# Altium schematic sheet BalEv_AIN_v1_0.SchDoc
size A3; CompanyName: HESSO; Address1: Route du Rawyl 47; Address2: 1950 Sion; Address3: Switzerland; DocumentNumber: 3; SheetNumber: 6; SheetTotal: 7; PageSetup: Record=PageOptions|CenterHorizontal=True|CenterVertical=True|PrintScale=1.00|XCorrection=1.00|YCorrection=1.00|PrintKind=1|BorderSize=5000000|LeftOffset=0|BottomOffset=0|Orientation=2|PaperLength=1000|PaperWidth=1000|Scale=100|PaperSource=15|PrintQuality=1200|MediaType=1|DitherType=10|PrintScaleMode=1|PaperKind=A4|PaperIndex=9; ProjectName: Project Name
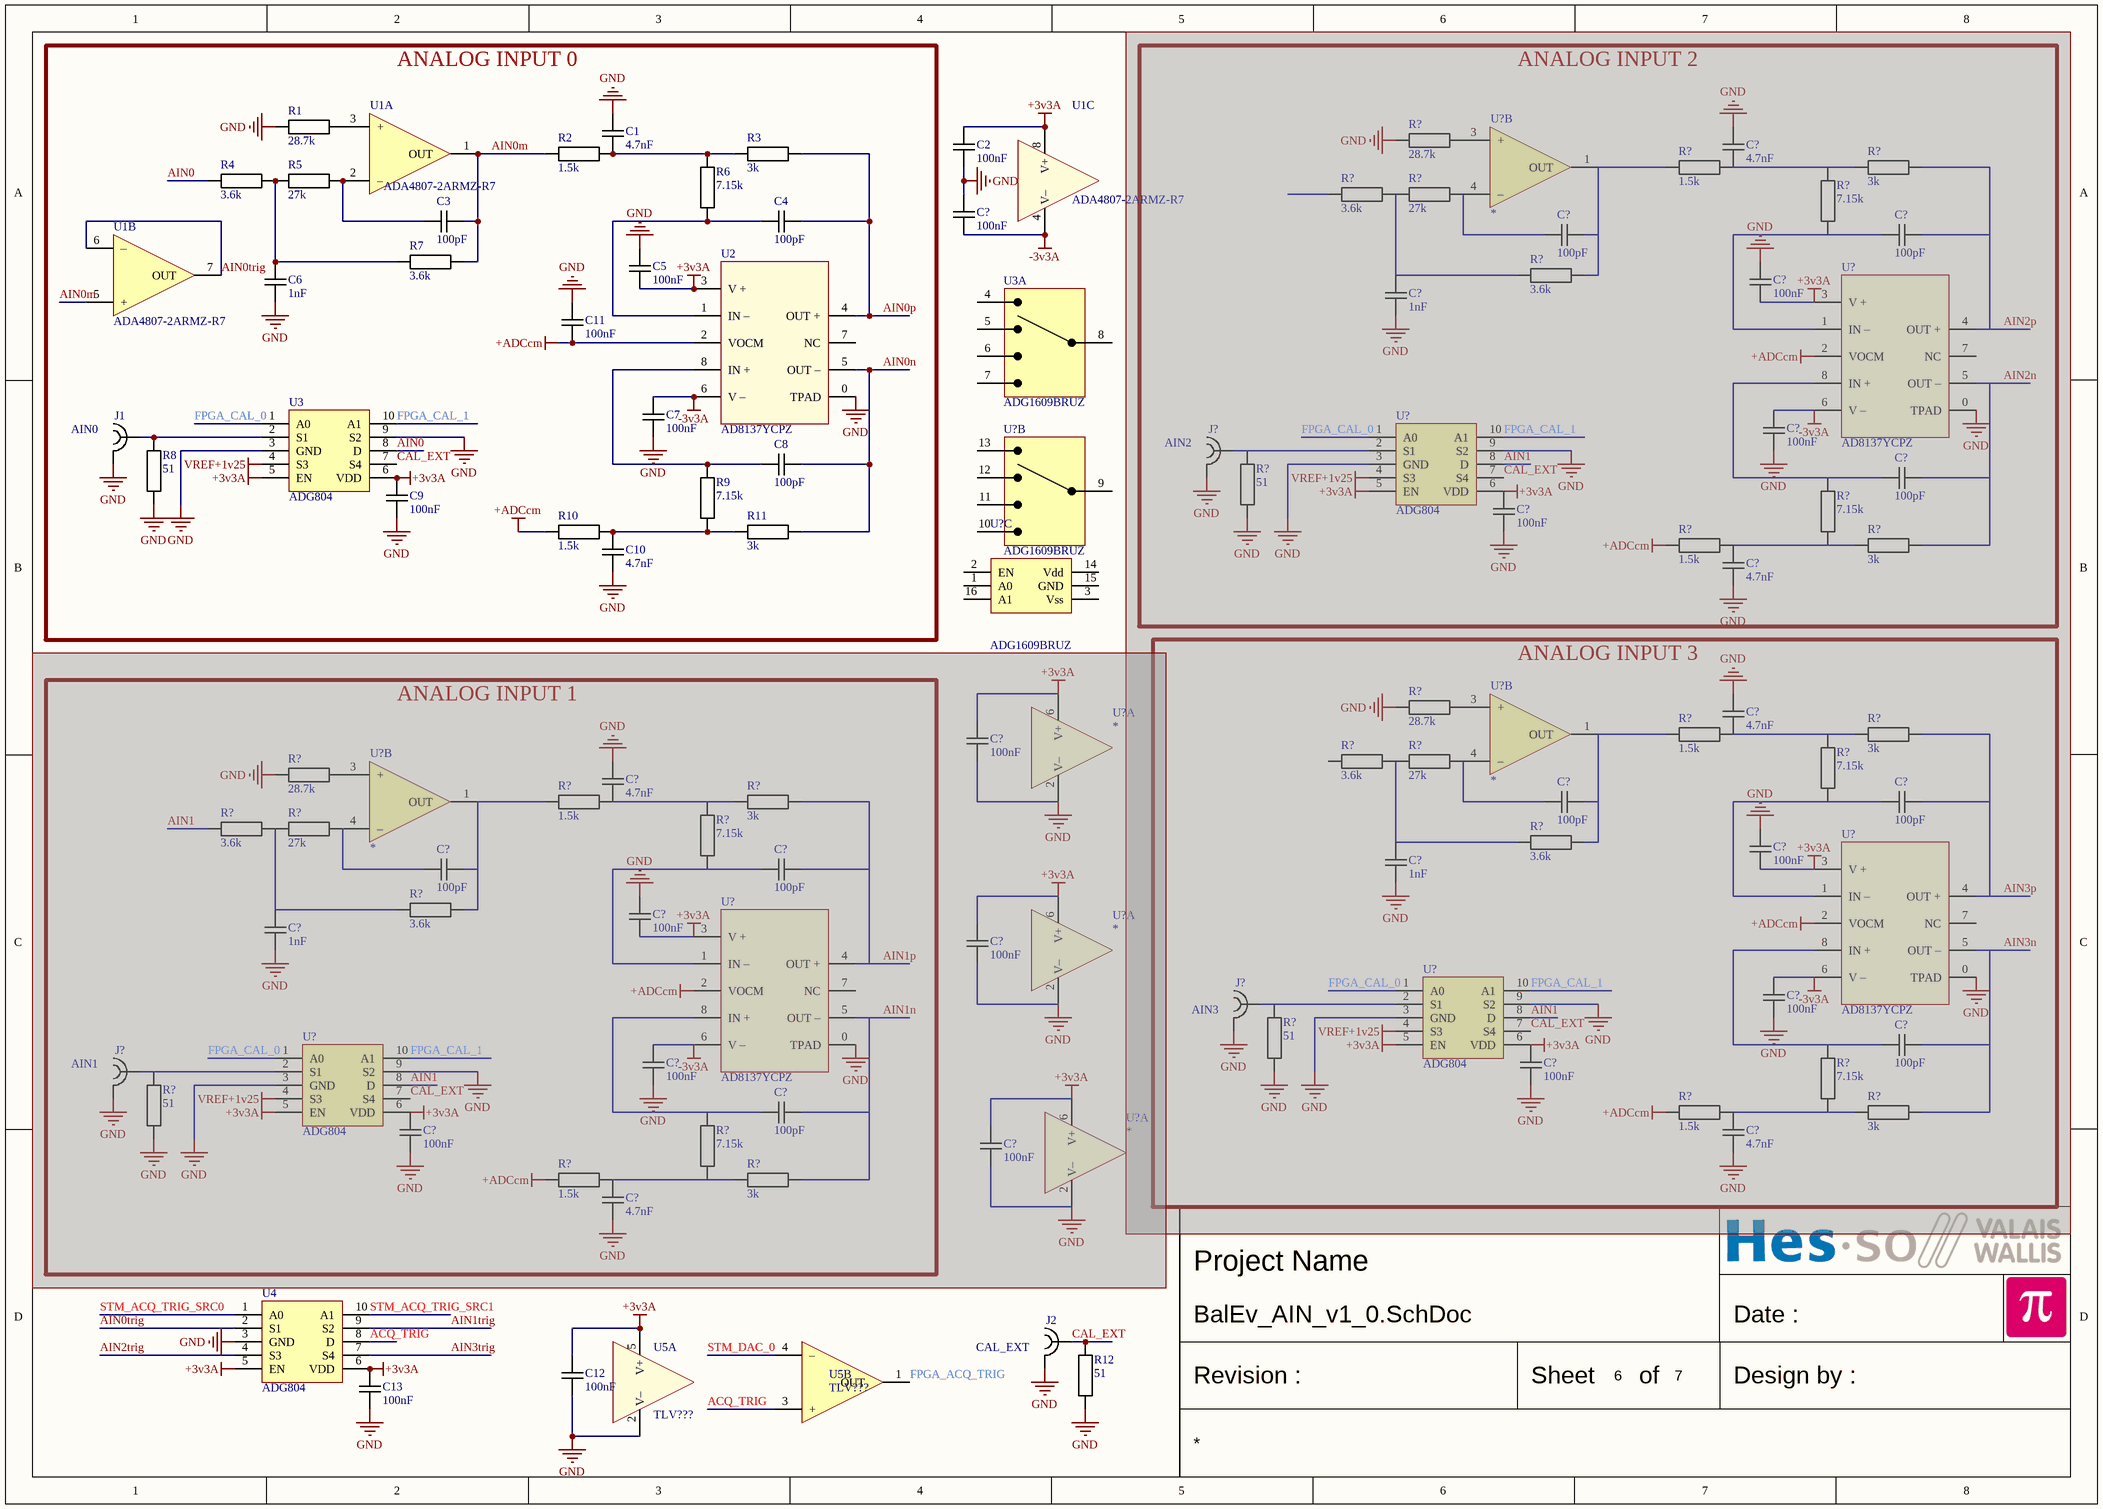
[diagram p0: BalEv_AIN_v1_0.SchDoc]

## Parts
(Parts that share a designator on the sheet are numbered #1, #2 ... from top to bottom, then left to right.)
C1  4.7nF  [CAPACITOR 1005 REFLOW]
C2  100nF  [CAPACITOR 1005 REFLOW]
C3  100pF  [CAPACITOR 1005 REFLOW]
C4  100pF  [CAPACITOR 1005 REFLOW]
C5  100nF  [CAPACITOR 1005 REFLOW]
C6  1nF  [CAPACITOR 1005 REFLOW]
C7  100nF  [CAPACITOR 1005 REFLOW]
C8  100pF  [CAPACITOR 1005 REFLOW]
C9  100nF  [CAPACITOR 1005 REFLOW]
C10  4.7nF  [CAPACITOR 1005 REFLOW]
C11  100nF  [CAPACITOR 1005 REFLOW]
C12  100nF  [CAPACITOR 1005 REFLOW]
C13  100nF  [CAPACITOR 1005 REFLOW]
C?#1  4.7nF  [CAPACITOR 1005 REFLOW]  (masked out: inside a compile mask, not in the netlist)
C?#2  100nF  [CAPACITOR 1005 REFLOW]
C?#3  100pF  [CAPACITOR 1005 REFLOW]  (masked out: inside a compile mask, not in the netlist)
C?#4  100pF  [CAPACITOR 1005 REFLOW]  (masked out: inside a compile mask, not in the netlist)
C?#5  100nF  [CAPACITOR 1005 REFLOW]  (masked out: inside a compile mask, not in the netlist)
C?#6  1nF  [CAPACITOR 1005 REFLOW]  (masked out: inside a compile mask, not in the netlist)
C?#7  100nF  [CAPACITOR 1005 REFLOW]  (masked out: inside a compile mask, not in the netlist)
C?#8  100pF  [CAPACITOR 1005 REFLOW]  (masked out: inside a compile mask, not in the netlist)
C?#9  100nF  [CAPACITOR 1005 REFLOW]  (masked out: inside a compile mask, not in the netlist)
C?#10  4.7nF  [CAPACITOR 1005 REFLOW]  (masked out: inside a compile mask, not in the netlist)
C?#11  4.7nF  [CAPACITOR 1005 REFLOW]  (masked out: inside a compile mask, not in the netlist)
C?#12  100nF  [CAPACITOR 1005 REFLOW]  (masked out: inside a compile mask, not in the netlist)
C?#13  4.7nF  [CAPACITOR 1005 REFLOW]  (masked out: inside a compile mask, not in the netlist)
C?#14  100pF  [CAPACITOR 1005 REFLOW]  (masked out: inside a compile mask, not in the netlist)
C?#15  100pF  [CAPACITOR 1005 REFLOW]  (masked out: inside a compile mask, not in the netlist)
C?#16  100nF  [CAPACITOR 1005 REFLOW]  (masked out: inside a compile mask, not in the netlist)
C?#17  1nF  [CAPACITOR 1005 REFLOW]  (masked out: inside a compile mask, not in the netlist)
C?#18  100pF  [CAPACITOR 1005 REFLOW]  (masked out: inside a compile mask, not in the netlist)
C?#19  100pF  [CAPACITOR 1005 REFLOW]  (masked out: inside a compile mask, not in the netlist)
C?#20  100nF  [CAPACITOR 1005 REFLOW]  (masked out: inside a compile mask, not in the netlist)
C?#21  1nF  [CAPACITOR 1005 REFLOW]  (masked out: inside a compile mask, not in the netlist)
C?#22  100nF  [CAPACITOR 1005 REFLOW]  (masked out: inside a compile mask, not in the netlist)
C?#23  100nF  [CAPACITOR 1005 REFLOW]  (masked out: inside a compile mask, not in the netlist)
C?#24  100nF  [CAPACITOR 1005 REFLOW]  (masked out: inside a compile mask, not in the netlist)
C?#25  100nF  [CAPACITOR 1005 REFLOW]  (masked out: inside a compile mask, not in the netlist)
C?#26  100pF  [CAPACITOR 1005 REFLOW]  (masked out: inside a compile mask, not in the netlist)
C?#27  100nF  [CAPACITOR 1005 REFLOW]  (masked out: inside a compile mask, not in the netlist)
C?#28  100pF  [CAPACITOR 1005 REFLOW]  (masked out: inside a compile mask, not in the netlist)
C?#29  4.7nF  [CAPACITOR 1005 REFLOW]  (masked out: inside a compile mask, not in the netlist)
C?#30  100nF  [CAPACITOR 1005 REFLOW]  (masked out: inside a compile mask, not in the netlist)
C?#31  4.7nF  [CAPACITOR 1005 REFLOW]  (masked out: inside a compile mask, not in the netlist)
J1  AIN0  [SMA EDGE Molex 732511150]
J2  CAL_EXT  [SMA EDGE Molex 732511150]
J?#1  AIN2  [SMA EDGE Molex 732511150]  (masked out: inside a compile mask, not in the netlist)
J?#2  AIN3  [SMA EDGE Molex 732511150]  (masked out: inside a compile mask, not in the netlist)
J?#3  AIN1  [SMA EDGE Molex 732511150]  (masked out: inside a compile mask, not in the netlist)
R1  28.7k  [RESISTOR 1005 REFLOW]
R2  1.5k  [RESISTOR 1005 REFLOW]
R3  3k  [RESISTOR 1005 REFLOW]
R4  3.6k  [RESISTOR 1005 REFLOW]
R5  27k  [RESISTOR 1005 REFLOW]
R6  7.15k  [RESISTOR 1005 REFLOW]
R7  3.6k  [RESISTOR 1005 REFLOW]
R8  51  [RESISTOR 1005 REFLOW]
R9  7.15k  [RESISTOR 1005 REFLOW]
R10  1.5k  [RESISTOR 1005 REFLOW]
R11  3k  [RESISTOR 1005 REFLOW]
R12  51  [RESISTOR 1005 REFLOW]
R?#1  28.7k  [RESISTOR 1005 REFLOW]  (masked out: inside a compile mask, not in the netlist)
R?#2  1.5k  [RESISTOR 1005 REFLOW]  (masked out: inside a compile mask, not in the netlist)
R?#3  3k  [RESISTOR 1005 REFLOW]  (masked out: inside a compile mask, not in the netlist)
R?#4  3.6k  [RESISTOR 1005 REFLOW]  (masked out: inside a compile mask, not in the netlist)
R?#5  27k  [RESISTOR 1005 REFLOW]  (masked out: inside a compile mask, not in the netlist)
R?#6  7.15k  [RESISTOR 1005 REFLOW]  (masked out: inside a compile mask, not in the netlist)
R?#7  3.6k  [RESISTOR 1005 REFLOW]  (masked out: inside a compile mask, not in the netlist)
R?#8  51  [RESISTOR 1005 REFLOW]  (masked out: inside a compile mask, not in the netlist)
R?#9  1.5k  [RESISTOR 1005 REFLOW]  (masked out: inside a compile mask, not in the netlist)
R?#10  7.15k  [RESISTOR 1005 REFLOW]  (masked out: inside a compile mask, not in the netlist)
R?#11  3k  [RESISTOR 1005 REFLOW]  (masked out: inside a compile mask, not in the netlist)
R?#12  28.7k  [RESISTOR 1005 REFLOW]  (masked out: inside a compile mask, not in the netlist)
R?#13  1.5k  [RESISTOR 1005 REFLOW]  (masked out: inside a compile mask, not in the netlist)
R?#14  3k  [RESISTOR 1005 REFLOW]  (masked out: inside a compile mask, not in the netlist)
R?#15  3.6k  [RESISTOR 1005 REFLOW]  (masked out: inside a compile mask, not in the netlist)
R?#16  27k  [RESISTOR 1005 REFLOW]  (masked out: inside a compile mask, not in the netlist)
R?#17  28.7k  [RESISTOR 1005 REFLOW]  (masked out: inside a compile mask, not in the netlist)
R?#18  1.5k  [RESISTOR 1005 REFLOW]  (masked out: inside a compile mask, not in the netlist)
R?#19  3k  [RESISTOR 1005 REFLOW]  (masked out: inside a compile mask, not in the netlist)
R?#20  7.15k  [RESISTOR 1005 REFLOW]  (masked out: inside a compile mask, not in the netlist)
R?#21  3.6k  [RESISTOR 1005 REFLOW]  (masked out: inside a compile mask, not in the netlist)
R?#22  27k  [RESISTOR 1005 REFLOW]  (masked out: inside a compile mask, not in the netlist)
R?#23  3.6k  [RESISTOR 1005 REFLOW]  (masked out: inside a compile mask, not in the netlist)
R?#24  7.15k  [RESISTOR 1005 REFLOW]  (masked out: inside a compile mask, not in the netlist)
R?#25  3.6k  [RESISTOR 1005 REFLOW]  (masked out: inside a compile mask, not in the netlist)
R?#26  51  [RESISTOR 1005 REFLOW]  (masked out: inside a compile mask, not in the netlist)
R?#27  1.5k  [RESISTOR 1005 REFLOW]  (masked out: inside a compile mask, not in the netlist)
R?#28  7.15k  [RESISTOR 1005 REFLOW]  (masked out: inside a compile mask, not in the netlist)
R?#29  3k  [RESISTOR 1005 REFLOW]  (masked out: inside a compile mask, not in the netlist)
R?#30  51  [RESISTOR 1005 REFLOW]  (masked out: inside a compile mask, not in the netlist)
R?#31  1.5k  [RESISTOR 1005 REFLOW]  (masked out: inside a compile mask, not in the netlist)
R?#32  7.15k  [RESISTOR 1005 REFLOW]  (masked out: inside a compile mask, not in the netlist)
R?#33  3k  [RESISTOR 1005 REFLOW]  (masked out: inside a compile mask, not in the netlist)
U1  ADA4807-2ARMZ-R7  [MSOP8 P0.65 C3.0X3.0 H1.1]  (parts A,B,C of 3)
U2  AD8137YCPZ  [LFCSP8 P0.5 C3.0x2.8 H1.0]
U3#1  ADG1609BRUZ  [TSOP65P640X120-16N]  (part A of 3)
U3#2  ADG804  [TSSOP50P490X110-10N]
U4  ADG804  [TSSOP50P490X110-10N]
U5  TLV???  [SOT23-5 P0.95 C1.6x3.0 H1.3]  (parts A,B of 2)
U?#1  *  [SOT23-6 P0.95 C1.5x3.0 H1.3]  (part B of 2)  (masked out: inside a compile mask, not in the netlist)
U?#2  AD8137YCPZ  [LFCSP8 P0.5 C3.0x2.8 H1.0]  (masked out: inside a compile mask, not in the netlist)
U?#3  ADG804  [TSSOP50P490X110-10N]  (masked out: inside a compile mask, not in the netlist)
U?#4  ADG1609BRUZ  [TSOP65P640X120-16N]  (part B of 3)
U?#5  ADG1609BRUZ  [TSOP65P640X120-16N]  (part C of 3)
U?#6  *  [SOT23-6 P0.95 C1.5x3.0 H1.3]  (part A of 2)  (masked out: inside a compile mask, not in the netlist)
U?#7  *  [SOT23-6 P0.95 C1.5x3.0 H1.3]  (part B of 2)  (masked out: inside a compile mask, not in the netlist)
U?#8  *  [SOT23-6 P0.95 C1.5x3.0 H1.3]  (part B of 2)  (masked out: inside a compile mask, not in the netlist)
U?#9  AD8137YCPZ  [LFCSP8 P0.5 C3.0x2.8 H1.0]  (masked out: inside a compile mask, not in the netlist)
U?#10  *  [SOT23-6 P0.95 C1.5x3.0 H1.3]  (part A of 2)  (masked out: inside a compile mask, not in the netlist)
U?#11  AD8137YCPZ  [LFCSP8 P0.5 C3.0x2.8 H1.0]  (masked out: inside a compile mask, not in the netlist)
U?#12  ADG804  [TSSOP50P490X110-10N]  (masked out: inside a compile mask, not in the netlist)
U?#13  ADG804  [TSSOP50P490X110-10N]  (masked out: inside a compile mask, not in the netlist)
U?#14  *  [SOT23-6 P0.95 C1.5x3.0 H1.3]  (part A of 2)  (masked out: inside a compile mask, not in the netlist)

## Blocks framed on the sheet
ANALOG INPUT 0: C1 C3-C11 J1 R1-R11 U1 U2 U3#2
ANALOG INPUT 2: C?#1 C?#3-C?#10 J?#1 R?#1-R?#11 U?#1-U?#3
ANALOG INPUT 3: C?#11 C?#14-C?#17 C?#23 C?#25 C?#26 C?#29 J?#2 R?#12-R?#16 R?#20 R?#23 R?#26-R?#29 U?#7 U?#9 U?#12
ANALOG INPUT 1: C?#13 C?#18-C?#21 C?#24 C?#27 C?#28 C?#31 J?#3 R?#17-R?#19 R?#21 R?#22 R?#24 R?#25 R?#30-R?#33 U?#8 U?#11 U?#13

## Nets
+3v3A: C2.1 C5.2 C9.1 C12.1 C13.1 U1.8(V+) U2.3(V_+) U3#2.5(EN) U3#2.6(VDD) U4.5(EN) U4.6(VDD) U5.5(V+)
+ADCcm: C11.2 R10.1 U2.2(VOCM)
-3v3A: C7.1 C?#2.2 U1.4(V–) U2.6(V_–)
GND: C1.1 C2.2 C5.1 C6.2 C7.2 C9.2 C10.2 C11.1 C12.2 C13.2 C?#2.1 J1.2 J2.2 R1.1 R8.1 R12.1 U2.0(TPAD) U3#2.3(GND) U3#2.9(S2) U4.3(GND) U5.2(V–)
VREF+1v25: U3#2.4(S3)
ACQ_TRIG: U4.8(D) U5.3(+)
AIN0: R4.1 U3#2.8(D)
AIN0m: C3.1 R2.1 R7.2 U1.1(OUT) U1.5(+)
AIN0n: C8.1 R11.2 U2.5(OUT_–)
AIN0p: C4.1 R3.2 U2.4(OUT_+)
AIN0trig: U1.6(–) U1.7(OUT) U4.2(S1)
AIN1trig: U4.9(S2)
AIN2trig: U4.4(S3)
AIN3trig: U4.7(S4)
CAL_EXT: J2.1 R12.2 U3#2.7(S4)
FPGA_ACQ_TRIG: U5.1(OUT)
FPGA_CAL_0: U3#2.1(A0)
FPGA_CAL_1: U3#2.10(A1)
STM_ACQ_TRIG_SRC0: U4.1(A0)
STM_ACQ_TRIG_SRC1: U4.10(A1)
STM_DAC_0: U5.4(–)
NetC1_2: C1.2 R2.2 R3.1 R6.2
NetC3_2: C3.2 R5.1 U1.2(–)
NetC4_2: C4.2 R6.1 U2.1(IN_–)
NetC6_1: C6.1 R4.2 R5.2 R7.1
NetC8_2: C8.2 R9.2 U2.8(IN_+)
NetC10_1: C10.1 R9.1 R10.2 R11.1
NetJ1_1: J1.1 R8.2 U3#2.2(S1)
NetR1_2: R1.2 U1.3(+)

Not connected (* = marked no-connect by the designer): U2 7(NC); U3#1 4(S1A) 5(S2A) 6(S3A) 7(S4A) 8(DA); U?#4 9(DB) 10(S4B) 11(S3B) 12(S2B) 13(S1B); U?#5 1(A0) 2(EN) 3(Vss) 14(Vdd) 15(GND) 16(A1)

## Notes on the sheet
- Date :
- Revision :
- Sheet
- of
- Design by :

## Library data of the parts
C1-C13 C?#1-C?#31 = Capacitor
  C1 C10 C?#1 C?#10 C?#11 C?#13 C?#29 C?#31: Value: 4.7nF
  C2 C5 C7 C9 C11-C13 C?#2 C?#5 C?#7 C?#9 C?#12 C?#16 C?#20 C?#22-C?#25 C?#27 C?#30: Value: 100nF
  C3 C4 C8 C?#3 C?#4 C?#8 C?#14 C?#15 C?#18 C?#19 C?#26 C?#28: Value: 100pF
  C6 C?#6 C?#17 C?#21: Value: 1nF
J1 J2 J?#1-J?#3 = SMA EDGE Molex 732511150
  J1: Value: AIN0
  J2: Value: CAL_EXT
  J?#1: Value: AIN2
  J?#2: Value: AIN3
  J?#3: Value: AIN1
R1-R12 R?#1-R?#33 = Resistor
  R1 R?#1 R?#12 R?#17: Value: 28.7k
  R2 R10 R?#2 R?#9 R?#13 R?#18 R?#27 R?#31: Value: 1.5k
  R3 R11 R?#3 R?#11 R?#14 R?#19 R?#29 R?#33: Value: 3k
  R4 R7 R?#4 R?#7 R?#15 R?#21 R?#23 R?#25: Value: 3.6k
  R5 R?#5 R?#16 R?#22: Value: 27k
  R6 R9 R?#6 R?#10 R?#20 R?#24 R?#28 R?#32: Value: 7.15k
  R8 R12 R?#8 R?#26 R?#30: Value: 51
U1 = OPA DUAL: Generic dual OPA 8 pins; Value: ADA4807-2ARMZ-R7
U2 U?#2 U?#9 U?#11 = AD8139ACP: IC OPAMP DIFF 410MHZ RRO 8LFCSP; Value: AD8137YCPZ
U3#1 U?#4 U?#5 = ADG1609: Value: ADG1609BRUZ
U5 = COMPARATOR SINGLE SOT23-5: Generic Single Comparator 5pins 1OUT/2-V/3+IN/4-IN/5+V; Value: TLV???
U?#1 U?#6-U?#8 U?#10 U?#14 = OPA SINGLE SD SOT23-6: Generic Single OPA 6pins 1OUT/2-V/3+IN/4-IN/5-SD/6+V; Value: *